# EAGLE schematic Skaarhoj BI8-SE-C30RGB (EAGLE 6.2)

## Sheet 1 of 2
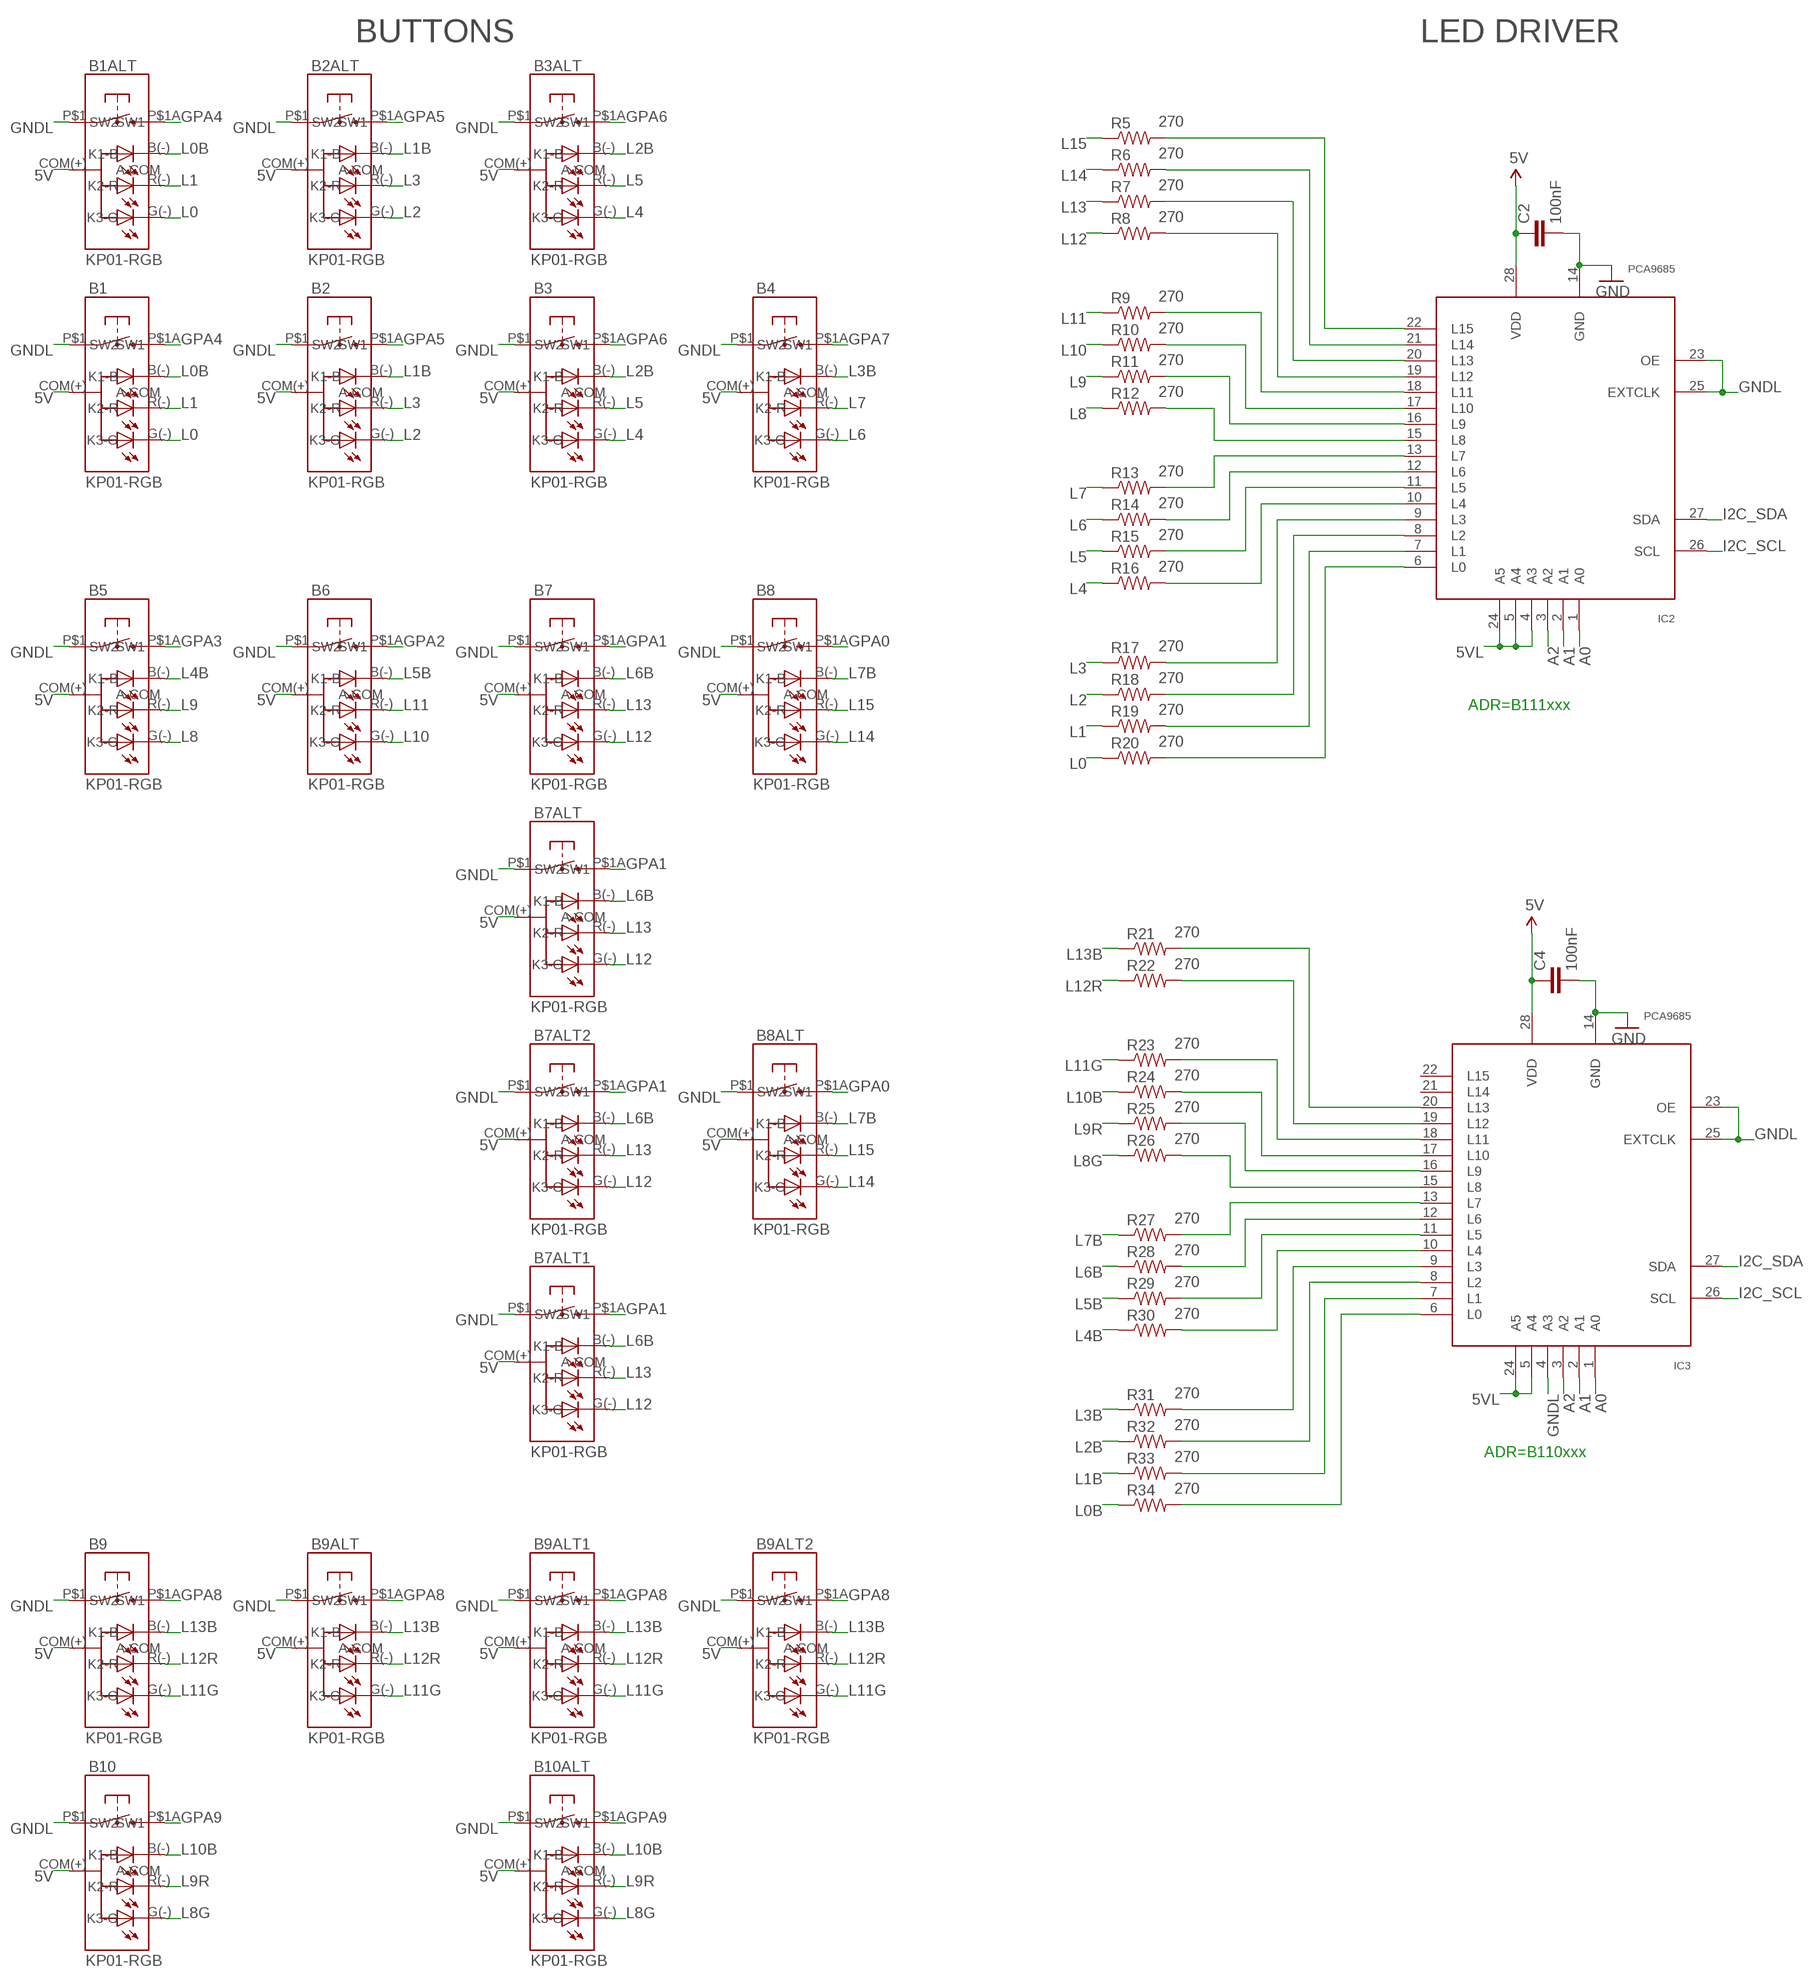
[diagram p0: schematic, sheet 1, part 1 of 2]
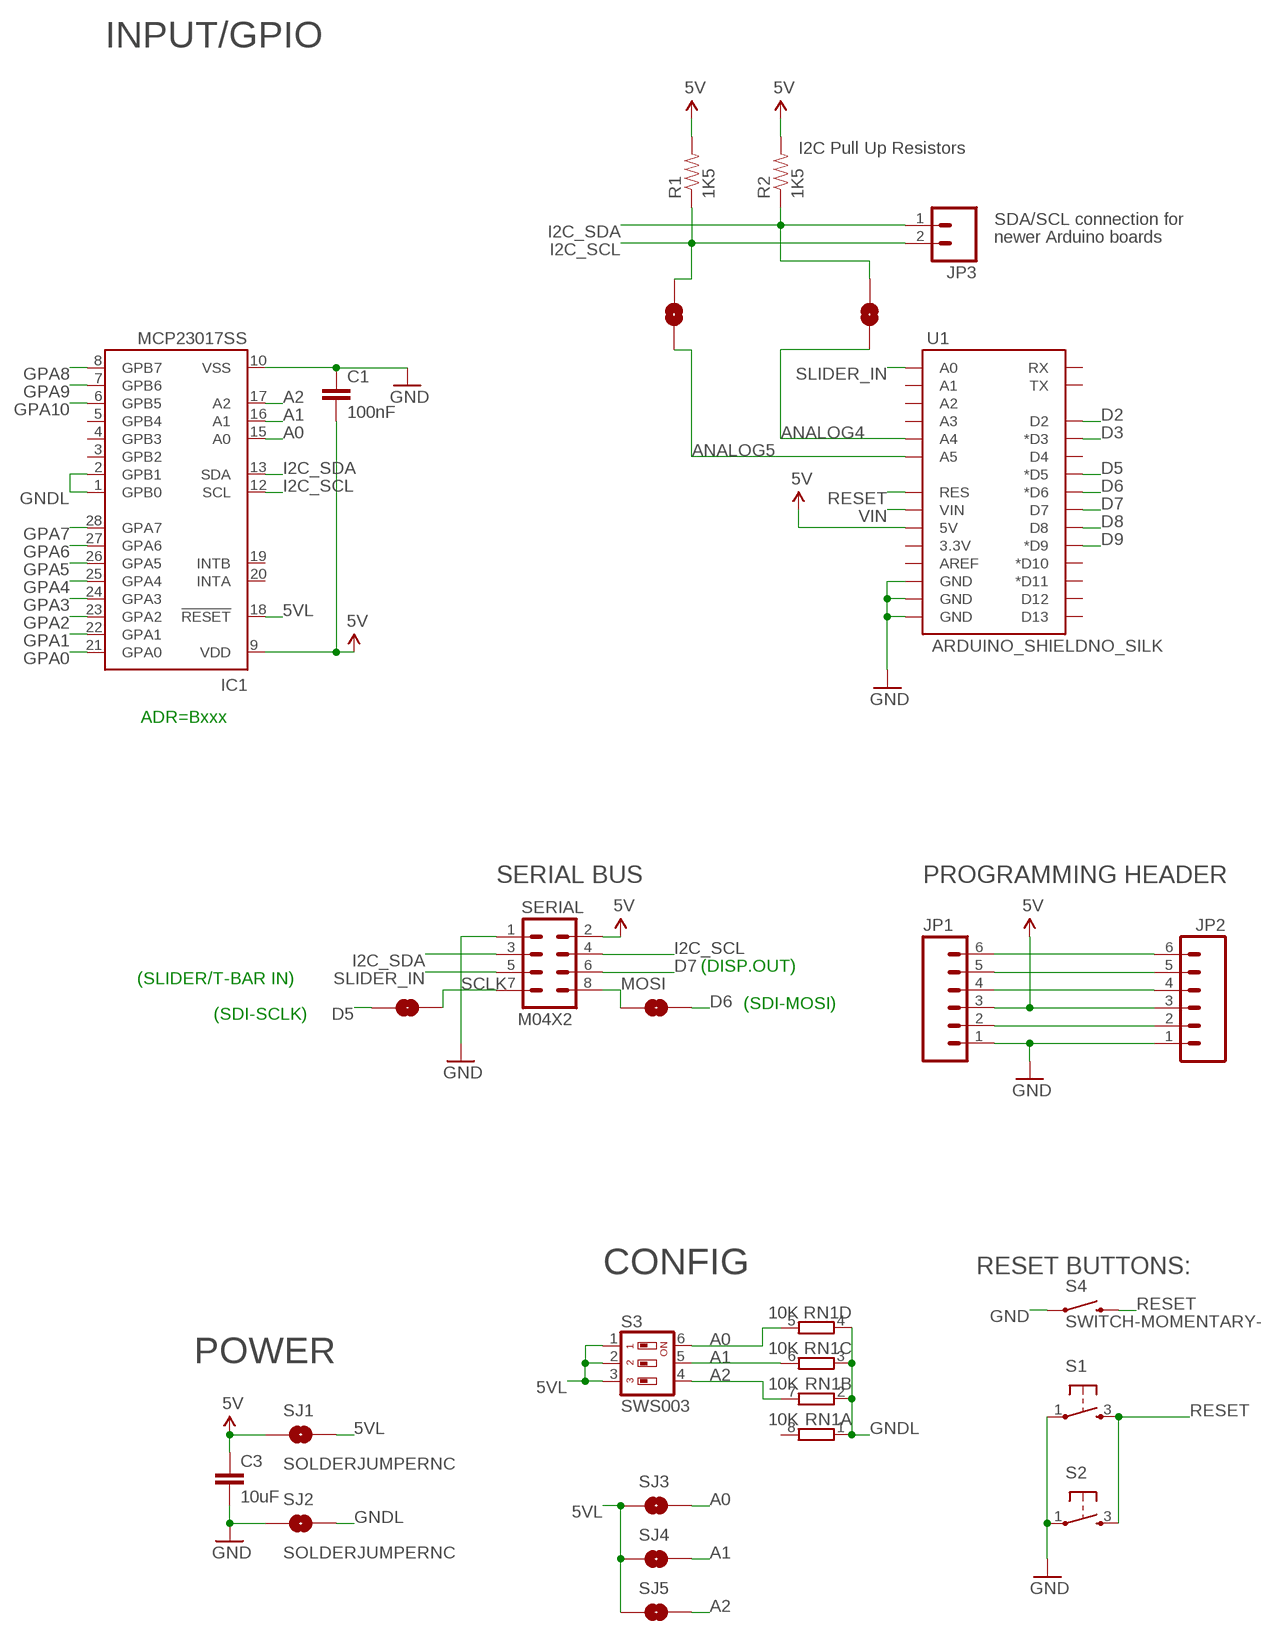
[diagram p1: schematic, sheet 1, part 2 of 2]

### Parts
B1  KP01-RGB  NKK-KP01  [NKK-KP01]
B1ALT  KP01-RGB  NKK-KP01  [NKK-KP01]
B2  KP01-RGB  NKK-KP01  [NKK-KP01]
B2ALT  KP01-RGB  NKK-KP01  [NKK-KP01]
B3  KP01-RGB  NKK-KP01  [NKK-KP01]
B3ALT  KP01-RGB  NKK-KP01  [NKK-KP01]
B4  KP01-RGB  NKK-KP01  [NKK-KP01]
B5  KP01-RGB  NKK-KP01  [NKK-KP01]
B6  KP01-RGB  NKK-KP01NKK-KP01_LESSHOLES  [NKK-KP01_LESSHOLES]
B7  KP01-RGB  NKK-KP01  [NKK-KP01]
B7ALT  KP01-RGB  NKK-KP01NKK-KP01_LESSHOLES  [NKK-KP01_LESSHOLES]
B7ALT1  KP01-RGB  NKK-KP01NKK-KP01_LESSHOLES  [NKK-KP01_LESSHOLES]
B7ALT2  KP01-RGB  NKK-KP01NKK-KP01_LESSHOLES  [NKK-KP01_LESSHOLES]
B8  KP01-RGB  NKK-KP01  [NKK-KP01]
B8ALT  KP01-RGB  NKK-KP01NKK-KP01_LESSHOLES  [NKK-KP01_LESSHOLES]
B9  KP01-RGB  NKK-KP01  [NKK-KP01]
B9ALT  KP01-RGB  NKK-KP01NKK-KP01_LESSHOLES  [NKK-KP01_LESSHOLES]
B9ALT1  KP01-RGB  NKK-KP01NKK-KP01_LESSHOLES  [NKK-KP01_LESSHOLES]
B9ALT2  KP01-RGB  NKK-KP01NKK-KP01_LESSHOLES  [NKK-KP01_LESSHOLES]
B10  KP01-RGB  NKK-KP01  [NKK-KP01]
B10ALT  KP01-RGB  NKK-KP01NKK-KP01_LESSHOLES  [NKK-KP01_LESSHOLES]
C1  100nF  CAP0603-CAP  [0603-CAP]
C2  100nF  CAP0603-CAP  [0603-CAP]
C3  10uF  CAP0805  [0805]
C4  100nF  CAP0603-CAP  [0603-CAP]
IC1  MCP23017SS  [SSOP28]
IC2  PCA9685  [TSSOP28]
IC3  PCA9685  [TSSOP28]
JP1  M06POLAR  [MOLEX-1X6]
JP2  M06POLAR  [MOLEX-1X6]
JP3  M02PTH  [1X02]
MOSI->D6  SOLDERJUMPERNC  [SJ_2S]
R1  1K5  RESISTOR0603-RES  [0603-RES]
R2  1K5  RESISTOR0603-RES  [0603-RES]
R5  270  RESISTOR0603-RES  [0603-RES]
R6  270  RESISTOR0603-RES  [0603-RES]
R7  270  RESISTOR0603-RES  [0603-RES]
R8  270  RESISTOR0603-RES  [0603-RES]
R9  270  RESISTOR0603-RES  [0603-RES]
R10  270  RESISTOR0603-RES  [0603-RES]
R11  270  RESISTOR0603-RES  [0603-RES]
R12  270  RESISTOR0603-RES  [0603-RES]
R13  270  RESISTOR0603-RES  [0603-RES]
R14  270  RESISTOR0603-RES  [0603-RES]
R15  270  RESISTOR0603-RES  [0603-RES]
R16  270  RESISTOR0603-RES  [0603-RES]
R17  270  RESISTOR0603-RES  [0603-RES]
R18  270  RESISTOR0603-RES  [0603-RES]
R19  270  RESISTOR0603-RES  [0603-RES]
R20  270  RESISTOR0603-RES  [0603-RES]
R21  270  RESISTOR0603-RES  [0603-RES]
R22  270  RESISTOR0603-RES  [0603-RES]
R23  270  RESISTOR0603-RES  [0603-RES]
R24  270  RESISTOR0603-RES  [0603-RES]
R25  270  RESISTOR0603-RES  [0603-RES]
R26  270  RESISTOR0603-RES  [0603-RES]
R27  270  RESISTOR0603-RES  [0603-RES]
R28  270  RESISTOR0603-RES  [0603-RES]
R29  270  RESISTOR0603-RES  [0603-RES]
R30  270  RESISTOR0603-RES  [0603-RES]
R31  270  RESISTOR0603-RES  [0603-RES]
R32  270  RESISTOR0603-RES  [0603-RES]
R33  270  RESISTOR0603-RES  [0603-RES]
R34  270  RESISTOR0603-RES  [0603-RES]
RN1  10K  4R-NCAY16  [CAY16_HAND]
S1  TAC_SWITCH  [PUSHBUTTON]
S2  TAC_SWITCH  [PUSHBUTTON]
S3  SWS003  [SMS-003]
S3->A2  SOLDERJUMPERNC  [SJ_2S]
S3->A3  SOLDERJUMPERNC  [SJ_2S]
S4  SWITCH-MOMENTARY-2  [TACTILE_SWITCH_TALL]
SCLK->D5  SOLDERJUMPERNC  [SJ_2S]
SERIAL  M04X2  [2X4]
SJ1  SOLDERJUMPERNC  [SJ_2S]
SJ2  SOLDERJUMPERNC  [SJ_2S]
SJ3  SOLDERJUMPERNC  [SJ_2S]
SJ4  SOLDERJUMPERNC  [SJ_2S]
SJ5  SOLDERJUMPERNC  [SJ_2S]
U1  ARDUINO_SHIELDNO_SILK  [DUEMILANOVE_VIAS]

### Nets
5V [Power]: B1.COM(+)(A-COM) B1ALT.COM(+)(A-COM) B2.COM(+)(A-COM) B2ALT.COM(+)(A-COM) B3.COM(+)(A-COM) B3ALT.COM(+)(A-COM) B4.COM(+)(A-COM) B5.COM(+)(A-COM) B6.COM(+)(A-COM) B7.COM(+)(A-COM) B7ALT1.COM(+)(A-COM) B7ALT2.COM(+)(A-COM) B7ALT.COM(+)(A-COM) B8.COM(+)(A-COM) B8ALT.COM(+)(A-COM) B9.COM(+)(A-COM) B9ALT1.COM(+)(A-COM) B9ALT2.COM(+)(A-COM) B9ALT.COM(+)(A-COM) B10.COM(+)(A-COM) B10ALT.COM(+)(A-COM) C1.2 C2.1 C3.1 C4.1 IC1.9(VDD) IC2.28(VDD) IC3.28(VDD) JP1.3 JP2.3 R1.2 R2.2 SERIAL.2 SJ1.1 U1.5V
5VL: IC1.18(!RESET) IC2.4(A3) IC2.5(A4) IC2.24(A5) IC3.5(A4) IC3.24(A5) S3.1 S3.2 S3.3 SJ1.2 SJ3.1 SJ4.1 SJ5.1
A0: IC1.15(A0) IC2.1(A0) IC3.1(A0) RN1.5 S3.6 SJ3.2
A1: IC1.16(A1) IC2.2(A1) IC3.2(A1) RN1.6 S3.5 SJ4.2
A2: IC1.17(A2) IC2.3(A2) IC3.3(A2) RN1.7 S3.4 SJ5.2
ANALOG4: S3->A3.2 U1.A4
ANALOG5: S3->A2.2 U1.A5
D2: U1.D2
D3: U1.D3(*D3)
D5: SCLK->D5.1 U1.D5(*D5)
D6: MOSI->D6.2 U1.D6(*D6)
D7: SERIAL.6 U1.D7
D8: U1.D8
D9: U1.D9(*D9)
GND [Power]: C1.1 C2.2 C3.2 C4.2 IC1.10(VSS) IC2.14(GND) IC3.14(GND) JP1.1 JP2.1 S1.1 S2.1 S4.A2 SERIAL.1 SJ2.1 U1.GND@0(GND) U1.GND@1(GND) U1.GND@2(GND)
GNDL: B1.P$1(SW1) B1ALT.P$1(SW1) B2.P$1(SW1) B2ALT.P$1(SW1) B3.P$1(SW1) B3ALT.P$1(SW1) B4.P$1(SW1) B5.P$1(SW1) B6.P$1(SW1) B7.P$1(SW1) B7ALT1.P$1(SW1) B7ALT2.P$1(SW1) B7ALT.P$1(SW1) B8.P$1(SW1) B8ALT.P$1(SW1) B9.P$1(SW1) B9ALT1.P$1(SW1) B9ALT2.P$1(SW1) B9ALT.P$1(SW1) B10.P$1(SW1) B10ALT.P$1(SW1) IC1.1(GPB0) IC1.2(GPB1) IC2.23(OE) IC2.25(EXTCLK) IC3.4(A3) IC3.23(OE) IC3.25(EXTCLK) RN1.1 RN1.2 RN1.3 RN1.4 SJ2.2
GPA0: B8.P$1A(SW2) B8ALT.P$1A(SW2) IC1.21(GPA0)
GPA1: B7.P$1A(SW2) B7ALT1.P$1A(SW2) B7ALT2.P$1A(SW2) B7ALT.P$1A(SW2) IC1.22(GPA1)
GPA2: B6.P$1A(SW2) IC1.23(GPA2)
GPA3: B5.P$1A(SW2) IC1.24(GPA3)
GPA4: B1.P$1A(SW2) B1ALT.P$1A(SW2) IC1.25(GPA4)
GPA5: B2.P$1A(SW2) B2ALT.P$1A(SW2) IC1.26(GPA5)
GPA6: B3.P$1A(SW2) B3ALT.P$1A(SW2) IC1.27(GPA6)
GPA7: B4.P$1A(SW2) IC1.28(GPA7)
GPA8: B9.P$1A(SW2) B9ALT1.P$1A(SW2) B9ALT2.P$1A(SW2) B9ALT.P$1A(SW2) IC1.8(GPB7)
GPA9: B10.P$1A(SW2) B10ALT.P$1A(SW2) IC1.7(GPB6)
GPA10: IC1.6(GPB5)
I2C_SCL: IC1.12(SCL) IC2.26(SCL) IC3.26(SCL) JP3.2 R1.1 S3->A2.1 SERIAL.4
I2C_SDA: IC1.13(SDA) IC2.27(SDA) IC3.27(SDA) JP3.1 R2.1 S3->A3.1 SERIAL.3
L0: B1.G(-)(K3-G) B1ALT.G(-)(K3-G) R20.1
L0B: B1.B(-)(K1-B) B1ALT.B(-)(K1-B) R34.1
L1: B1.R(-)(K2-R) B1ALT.R(-)(K2-R) R19.1
L1B: B2.B(-)(K1-B) B2ALT.B(-)(K1-B) R33.1
L2: B2.G(-)(K3-G) B2ALT.G(-)(K3-G) R18.1
L2B: B3.B(-)(K1-B) B3ALT.B(-)(K1-B) R32.1
L3: B2.R(-)(K2-R) B2ALT.R(-)(K2-R) R17.1
L3B: B4.B(-)(K1-B) R31.1
L4: B3.G(-)(K3-G) B3ALT.G(-)(K3-G) R16.1
L4B: B5.B(-)(K1-B) R30.1
L5: B3.R(-)(K2-R) B3ALT.R(-)(K2-R) R15.1
L5B: B6.B(-)(K1-B) R29.1
L6: B4.G(-)(K3-G) R14.1
L6B: B7.B(-)(K1-B) B7ALT1.B(-)(K1-B) B7ALT2.B(-)(K1-B) B7ALT.B(-)(K1-B) R28.1
L7: B4.R(-)(K2-R) R13.1
L7B: B8.B(-)(K1-B) B8ALT.B(-)(K1-B) R27.1
L8: B5.G(-)(K3-G) R12.1
L8G: B10.G(-)(K3-G) B10ALT.G(-)(K3-G) R26.1
L9: B5.R(-)(K2-R) R11.1
L9R: B10.R(-)(K2-R) B10ALT.R(-)(K2-R) R25.1
L10: B6.G(-)(K3-G) R10.1
L10B: B10.B(-)(K1-B) B10ALT.B(-)(K1-B) R24.1
L11: B6.R(-)(K2-R) R9.1
L11G: B9.G(-)(K3-G) B9ALT1.G(-)(K3-G) B9ALT2.G(-)(K3-G) B9ALT.G(-)(K3-G) R23.1
L12: B7.G(-)(K3-G) B7ALT1.G(-)(K3-G) B7ALT2.G(-)(K3-G) B7ALT.G(-)(K3-G) R8.1
L12R: B9.R(-)(K2-R) B9ALT1.R(-)(K2-R) B9ALT2.R(-)(K2-R) B9ALT.R(-)(K2-R) R22.1
L13: B7.R(-)(K2-R) B7ALT1.R(-)(K2-R) B7ALT2.R(-)(K2-R) B7ALT.R(-)(K2-R) R7.1
L13B: B9.B(-)(K1-B) B9ALT1.B(-)(K1-B) B9ALT2.B(-)(K1-B) B9ALT.B(-)(K1-B) R21.1
L14: B8.G(-)(K3-G) B8ALT.G(-)(K3-G) R6.1
L15: B8.R(-)(K2-R) B8ALT.R(-)(K2-R) R5.1
MOSI: MOSI->D6.1 SERIAL.8
N$1: JP1.2 JP2.2
N$2: IC3.13(L7) R27.2
N$3: IC3.12(L6) R28.2
N$4: IC2.13(L7) R13.2
N$5: IC2.12(L6) R14.2
N$6: IC3.11(L5) R29.2
N$7: IC2.11(L5) R15.2
N$9: IC2.10(L4) R16.2
N$10: IC2.9(L3) R17.2
N$11: IC2.8(L2) R18.2
N$12: IC2.7(L1) R19.2
N$13: IC3.10(L4) R30.2
N$14: IC3.9(L3) R31.2
N$15: IC3.8(L2) R32.2
N$16: IC3.7(L1) R33.2
N$17: IC3.6(L0) R34.2
N$18: IC3.15(L8) R26.2
N$19: IC2.6(L0) R20.2
N$20: IC2.15(L8) R12.2
N$21: IC2.16(L9) R11.2
N$22: IC2.17(L10) R10.2
N$23: IC2.18(L11) R9.2
N$24: IC2.19(L12) R8.2
N$25: IC2.20(L13) R7.2
N$26: IC2.21(L14) R6.2
N$27: IC2.22(L15) R5.2
N$28: IC3.16(L9) R25.2
N$29: IC3.17(L10) R24.2
N$30: IC3.18(L11) R23.2
N$31: IC3.19(L12) R22.2
N$32: IC3.20(L13) R21.2
N$33: JP1.4 JP2.4
N$34: JP1.5 JP2.5
N$45: JP1.6 JP2.6
RESET: S1.3 S2.3 S4.B2 U1.RES
SCLK: SCLK->D5.2 SERIAL.7
SLIDER_IN: SERIAL.5 U1.A0
VIN [Power]: U1.VIN
Unconnected: IC1.3(GPB2) IC1.4(GPB3) IC1.5(GPB4) IC1.19(INTB) IC1.20(INTA) IC3.21(L14) IC3.22(L15) RN1.8 U1.3.3V U1.A1 U1.A2 U1.A3 U1.AREF U1.D4 U1.D10(*D10) U1.D11(*D11) U1.D12 U1.D13 U1.RX U1.TX

### Notes on the sheet
- BUTTONS | LED DRIVER | INPUT/GPIO
- I2C Pull Up Resistors
- SDA/SCL connection for
- newer Arduino boards
- ADR=Bxxx
- ADR=B111xxx
- SERIAL BUS | PROGRAMMING HEADER
- (DISP.OUT)
- (SLIDER/T-BAR IN)
- (SDI-MOSI)
- (SDI-SCLK)
- CONFIG | RESET BUTTONS:
- POWER
- ADR=B110xxx

## Sheet 2 of 2

## Library data of the parts
B1 B1ALT B2 B2ALT B3 B3ALT B4-B7 B7ALT B7ALT1 B7ALT2 B8 B8ALT B9 B9ALT B9ALT1 B9ALT2 B10 B10ALT = SKAARHOJ:NKK-KP01: NKK-KP01-15AC 100mA12VDC
C1-C4 = SparkFun:CAP: Capacitor Standard 0603 ceramic capacitor, and 0.1" leaded capacitor.
IC1 = microchip:MCP23017: http://ww1.microchip.com/downloads/en/DeviceDoc/21952a.pdf Source: http://ww1.microchip.com/downloads/en/DeviceDoc/21952a.pdf; MF: MICROCHIP; MPN: MCP23017-E/SS; OC_FARNELL: 1467674; OC_NEWARK: 31K2960
IC2 IC3 = wsmith:PCA9685
JP1 JP2 = SparkFun:M06: Header 6 Standard 6-pin 0.1" header. Use with straight break away headers (SKU : PRT-00116), right angle break away headers (PRT-00553), swiss pins (PRT-00743), machine pins (PRT-00117), and female headers (PRT-00115). Molex polarized connector foot print use with SKU : PRT-08094 with associated crimp pins and housings. NOTES ON THE VARIANTS LOCK and LOCK_LONGPADS... This footprint was designed to help hold the alignment of a through-hole component (i.e. 6-pin header) while soldering it into place. You may notice that each hole has been shifted either up or down by 0.005 of an inch from it's more standard position (which is a perfectly straight line). This slight alteration caused the pins (the squares in the middle) to touch the edges of the holes. Because they are alternating, it causes a "brace" to hold the component in place. 0.005 has proven to be the perfect amount of "off-center" position when using our standard breakaway headers. Although looks a little odd when you look at the bare footprint, once you have a header in there, the alteration is very hard to notice. Also, if you push a header all the way into place, it is covered up entirely on the bottom side. This idea of altering the position of holes to aid alignment will be further integrated into the Sparkfun Library for other footprints. It can help hold any component with 3 or more connection pins.
JP3 = SparkFun:M02: Header 2 Standard 2-pin 0.1" header. Use with straight break away headers (SKU : PRT-00116), right angle break away headers (PRT-00553), swiss pins (PRT-00743), machine pins (PRT-00117), and female headers (PRT-00115). Molex polarized connector foot print use with SKU : PRT-08233 with associated crimp pins and housings.
MOSI->D6 S3->A2 S3->A3 SCLK->D5 SJ1-SJ5 = SparkFun:SOLDERJUMPER: Solder Jumper Standard SMD solder jumper. Used to automate production. Two varients : Normally Open and Normally Closed are the same, but have different paste layers. NC will have a large amount of paste and should jumper during reflow.
R1 R2 R5-R34 = SparkFun:RESISTOR: Resistor Basic schematic elements and footprints for 0603, 1206, and PTH resistors.
RN1 = SKAARHOJ:4R-N: Array Chip Resistor Source: RS Component / Phycomp; OC_FARNELL: unknown; OC_NEWARK: unknown
S1 S2 = SKAARHOJ:TAC_SWITCH: Momentary Switch Button commonly used for reset or general input. Spark Fun Electronics SKU : COM-00097
S3 = smd-special:SWS003: SMD Dip Switch 3 pol.
S4 = SparkFun:SWITCH-MOMENTARY-2
SERIAL = SparkFun:M04X2
U1 = SparkFun:ARDUINO_SHIELD

## Net classes
0 default: width 0.152 mm, drill 0.254 mm, clearance 0.152 mm
1 Power: width 0.406 mm, drill 0.61 mm, clearance 0.203 mm